# EAGLE design Aspen_Fever (EAGLE 9.6.2)
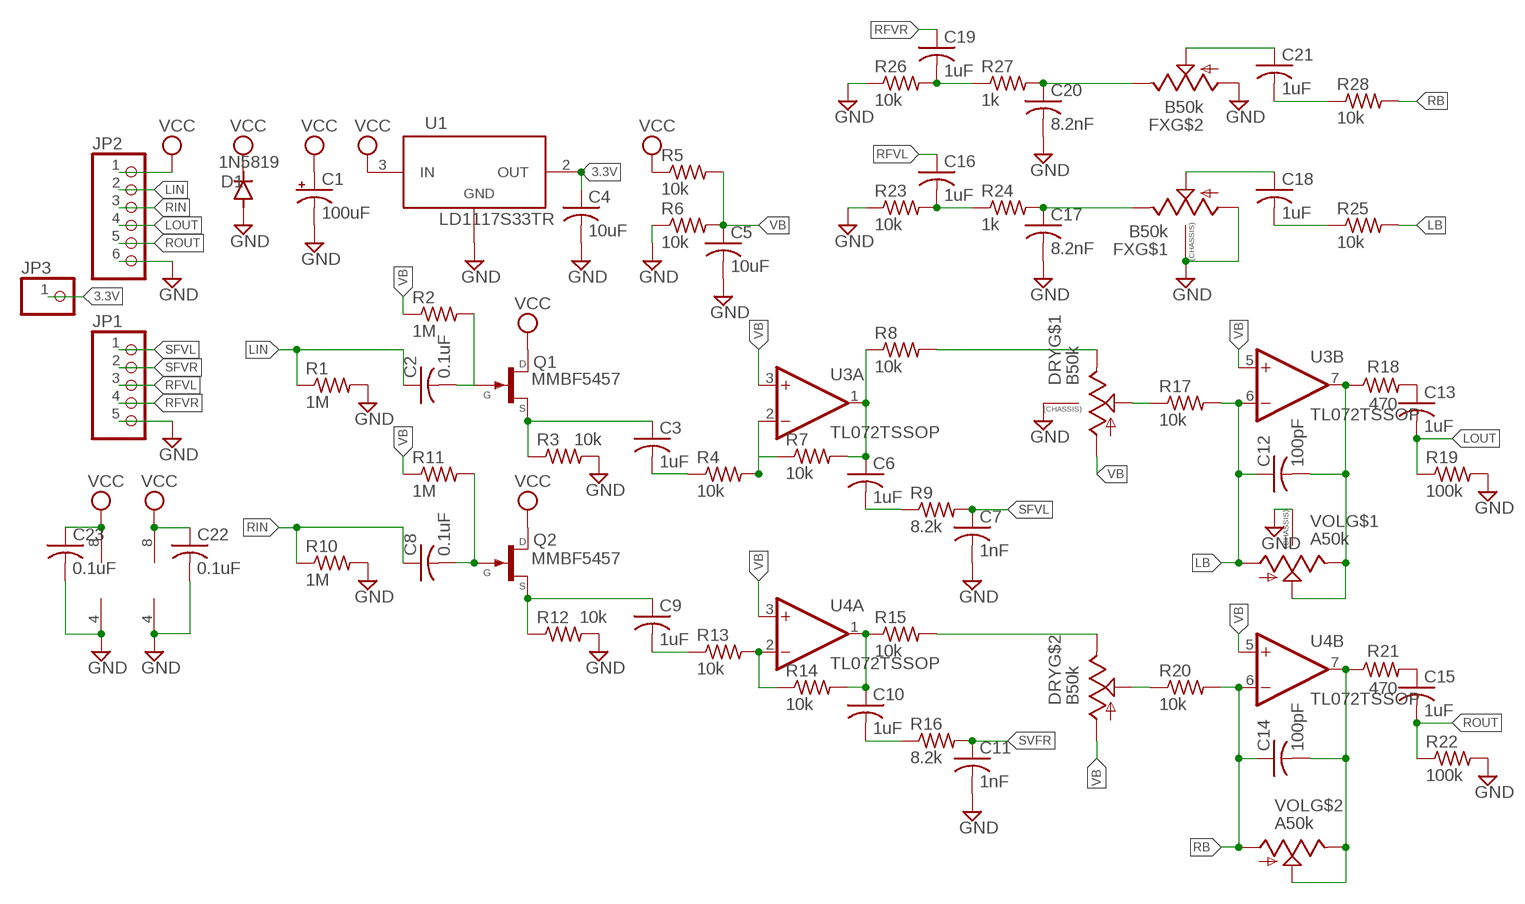
[diagram p0: schematic, sheet 1]

## Parts
C1  100uF  CAP_SMD+THRUPAN_B  [PAN_B_SMD+THRU]
C2  0.1uF  C-USC0402  [C0402]
C3  1uF  C-USC0603  [C0603]
C4  10uF  C-USC0805  [C0805]
C5  10uF  C-USC0805  [C0805]
C6  1uF  C-USC0603  [C0603]
C7  1nF  C-USC0402  [C0402]
C8  0.1uF  C-USC0402  [C0402]
C9  1uF  C-USC0603  [C0603]
C10  1uF  C-USC0603  [C0603]
C11  1nF  C-USC0402  [C0402]
C12  100pF  C-USC0402  [C0402]
C13  1uF  C-USC0603  [C0603]
C14  100pF  C-USC0402  [C0402]
C15  1uF  C-USC0603  [C0603]
C16  1uF  C-USC0603  [C0603]
C17  8.2nF  C-USC0402  [C0402]
C18  1uF  C-USC0603  [C0603]
C19  1uF  C-USC0603  [C0603]
C20  8.2nF  C-USC0402  [C0402]
C21  1uF  C-USC0603  [C0603]
C22  0.1uF  C-USC0402  [C0402]
C23  0.1uF  C-USC0402  [C0402]
D1  1N5819  DIODE-SOD123  [SOD123]
DRY  B50k  ALPHA-9MM-DUALPOT  [DUAL_9MM_SNAP-IN_POT]
FX  B50k  ALPHA-9MM-DUALPOT  [DUAL_9MM_SNAP-IN_POT]
JP1  PINHD-1X5  [1X05]
JP2  PINHD-1X6  [1X06]
JP3  PINHD-1X1  [1X01]
Q1  MMBF5457  [SOT23]
Q2  MMBF5457  [SOT23]
R1  1M  R-US_R0402  [R0402]
R2  1M  R-US_R0402  [R0402]
R3  10k  R-US_R0402  [R0402]
R4  10k  R-US_R0402  [R0402]
R5  10k  R-US_R0402  [R0402]
R6  10k  R-US_R0402  [R0402]
R7  10k  R-US_R0402  [R0402]
R8  10k  R-US_R0402  [R0402]
R9  8.2k  R-US_R0402  [R0402]
R10  1M  R-US_R0402  [R0402]
R11  1M  R-US_R0402  [R0402]
R12  10k  R-US_R0402  [R0402]
R13  10k  R-US_R0402  [R0402]
R14  10k  R-US_R0402  [R0402]
R15  10k  R-US_R0402  [R0402]
R16  8.2k  R-US_R0402  [R0402]
R17  10k  R-US_R0402  [R0402]
R18  470  R-US_R0402  [R0402]
R19  100k  R-US_R0402  [R0402]
R20  10k  R-US_R0402  [R0402]
R21  470  R-US_R0402  [R0402]
R22  100k  R-US_R0402  [R0402]
R23  10k  R-US_R0402  [R0402]
R24  1k  R-US_R0402  [R0402]
R25  10k  R-US_R0402  [R0402]
R26  10k  R-US_R0402  [R0402]
R27  1k  R-US_R0402  [R0402]
R28  10k  R-US_R0402  [R0402]
U1  LD1117S33TR  [SOT-223]
U3  TL072TSSOP  [TSSOP-8]
U4  TL072TSSOP  [TSSOP-8]
VOL  A50k  ALPHA-9MM-DUALPOT  [DUAL_9MM_SNAP-IN_POT]

## Nets
3.3V: C4.1 JP3.1 U1.2(OUT) U1.4
GND: C1.- C1.--(-) C4.2 C5.2 C7.2 C11.2 C17.2 C20.2 C22.2 C23.2 D1.A DRY.CHASSIS1 DRY.CHASSIS2 FX.1(A) FX.1B(A) FX.CHASSIS1 FX.CHASSIS2 JP1.5 JP2.6 R1.2 R3.2 R6.1 R10.2 R12.2 R19.2 R22.2 R23.1 R26.1 U1.1(ADJ/GND) U3.4(P:V-) U4.4(P:V-) VOL.CHASSIS1 VOL.CHASSIS2
LB: C12.1 R17.2 R25.2 U3.6(B:-IN) VOL.1(A)
LIN: C2.1 JP2.2 R1.1
LOUT: C13.2 JP2.4 R19.1
N$1: C6.2 R9.1
N$2: C2.2 Q1.3(G) R2.2
N$3: C3.1 Q1.2(S) R3.1
N$4: C3.2 R4.1
N$5: R4.2 R7.1 U3.2(A:-IN)
N$6: C6.1 R7.2 R8.1 U3.1(A:OUT)
N$7: DRY.3(E) R8.2
N$8: C8.2 Q2.3(G) R11.2
N$9: C9.1 Q2.2(S) R12.1
N$10: R13.2 R14.1 U4.2(A:-IN)
N$11: C9.2 R13.1
N$12: C10.1 R14.2 R15.1 U4.1(A:OUT)
N$13: DRY.3B(E) R15.2
N$14: C10.2 R16.1
N$15: DRY.2(S) R17.1
N$16: C13.1 R18.2
N$17: C19.2 R26.2 R27.1
N$18: C12.2 R18.1 U3.7(B:OUT) VOL.2(S) VOL.3(E)
N$19: C16.2 R23.2 R24.1
N$21: DRY.2B(S) R20.1
N$22: C14.2 R21.1 U4.7(B:OUT) VOL.2B(S) VOL.3B(E)
N$23: C15.1 R21.2
N$24: C17.1 FX.3(E) R24.2
N$25: C18.2 R25.1
N$26: C18.1 FX.2(S)
N$27: C20.1 FX.3B(E) R27.2
N$28: C21.1 FX.2B(S)
N$29: C21.2 R28.1
RB: C14.1 R20.2 R28.2 U4.6(B:-IN) VOL.1B(A)
RFVL: C16.1 JP1.3
RFVR: C19.1 JP1.4
RIN: C8.1 JP2.3 R10.1
ROUT: C15.2 JP2.5 R22.1
SFVL: C7.1 JP1.1 R9.2
SFVR: JP1.2
SVFR: C11.1 R16.2
VB: C5.1 DRY.1(A) DRY.1B(A) R2.1 R5.2 R6.2 R11.1 U3.3(A:+IN) U3.5(B:+IN) U4.3(A:+IN) U4.5(B:+IN)
VCC: C1.+ C1.++(+) C22.1 C23.1 D1.C JP2.1 Q1.1(D) Q2.1(D) R5.1 U1.3(IN) U3.8(P:V+) U4.8(P:V+)

## Library data of the parts
C1 = MusicThingModular:CAP_SMD+THRU
C2-C23 = adafruit:C-US: CAPACITOR, American symbol
D1 = diode:DIODE-: DIODE
DRY FX VOL = MusicThingModular:ALPHA-9MM-DUALPOT: 9mm vertical snap-in pot, Alpha / Panasonic style, with a connection to the metal chassis for grounding
JP1 = pinhead:PINHD-1X5: PIN HEADER
JP2 = pinhead:PINHD-1X6: PIN HEADER
JP3 = pinhead:PINHD-1X1: PIN HEADER
Q1 Q2 = MMBF5457:MMBF5457*: N-Channel JFET; AVAILABILITY: Unavailable; DESCRIPTION: JFET N-Channel 25V 350mW Surface Mount SOT-23-3; MF: ON Semiconductor; MP: MMBF5457; PACKAGE: SOT-23-3 Fairchild Semiconductor; PRICE: None
R1-R28 = adafruit:R-US_: RESISTOR, American symbol
U1 = IC:LD1117S33TR: IC REG LINEAR 3.3V 800MA SOT223 Manufacturer's datasheet <http://www.st.com/content/ccc/resource/technical/document/datasheet/99/3b/7d/91/91/51/4b/be/CD00000544.pdf/files/CD00000544.pdf/jcr:content/translations/en.CD00000544.pdf>; CREATED_BY: PCBLayout.com; DIGIKEY_PART_NUMBER: 497-1242-2-ND; MANUFACTURER: STMicroelectronics; MPN: LD1117S33TR; PACKAGE: SOT-223
U3 U4 = MusicThingModular:TL072: Generic Dual Op Amp

## Board
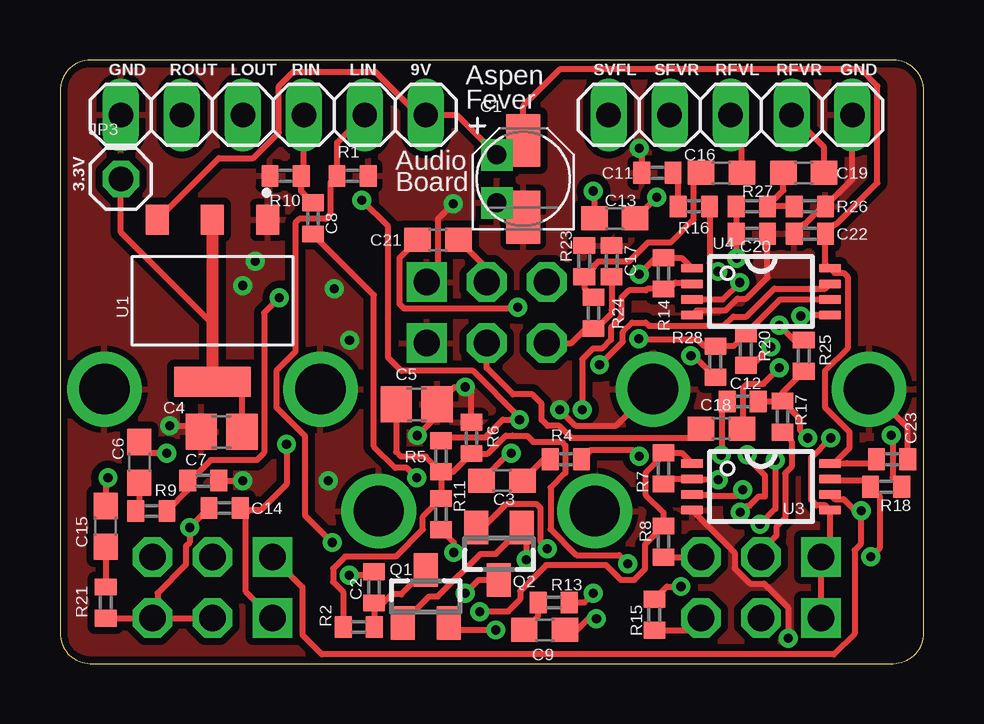
[diagram p1: board, top side]
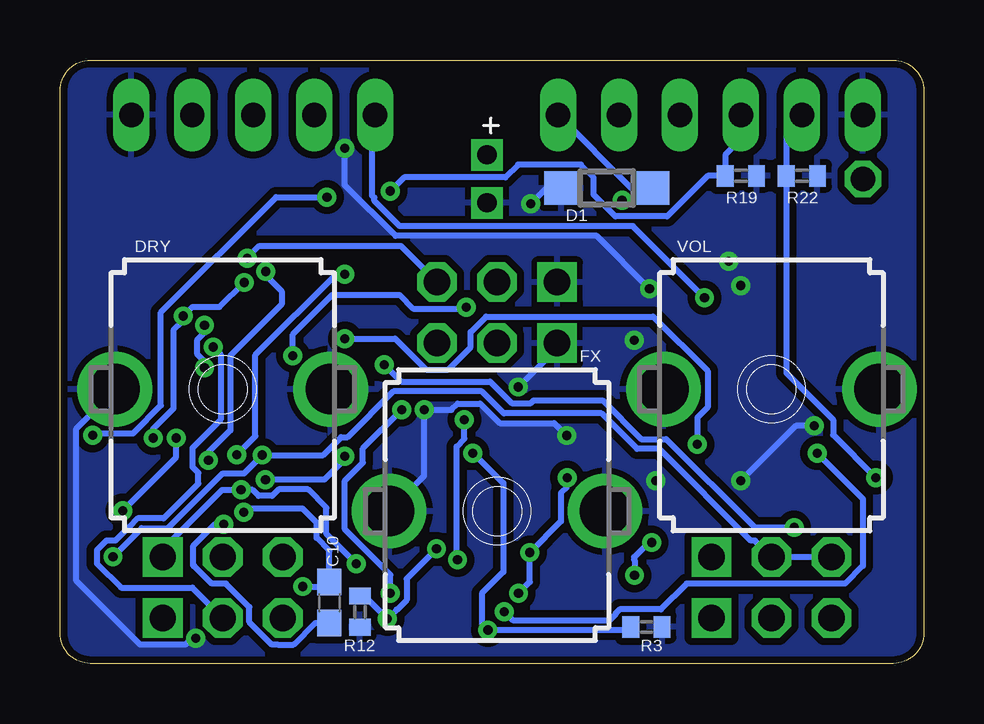
[diagram p2: board, bottom side, seen from below]

Size 35.99 x 25.14 mm. Coordinates in mm from the lower left corner, seen from the top.
Outline: 0,23.87 0,1.27 arc90 1.27,0 34.72,0 arc90 35.99,1.27 35.99,23.87 arc90 34.72,25.14 1.27,25.14 arc90 0,23.87
Copper layers (1*16): Top 0.035mm / dielectric 1.5mm / Bottom 0.035mm
Design rules "default *": minimum track width 6mil, minimum drill 0.35mm, track to track 6mil, track to pad 6mil, pad to pad 6mil, via to via 6mil, smd to smd 6mil, copper to edge 10mil, drill to drill 6mil, minimum pad ring 10mil, minimum via ring 8mil, stop-mask expansion 4mil, vias tented up to drill 0mil, thermal gap 10mil

### Footprints (pad centres in the part's own frame; a part is rotated, then mirrored left to right if it is on the bottom)
PAN_B_SMD+THRU = smd 2.2 x 1.4: + 1.6,0; - -1.6,0 | drill 0.8 pad 0.9 square: ++ 1,1.1; -- -1,1.1
C0402 = smd 0.7 x 0.9: 1 -0.65,0; 2 0.65,0
C0603 = smd 1.1 x 1: 1 -0.85,0; 2 0.85,0
C0805 = smd 1.3 x 1.5: 1 -0.85,0; 2 0.85,0
SOD123 = smd 1.4 x 1.4: A 1.9,0; C -1.9,0
DUAL_9MM_SNAP-IN_POT = drill 1.1 square: 1 -2.5,-7; 1B -2.5,-9.54 | drill 1.1 octagon: 2 0,-7; 2B 0,-9.54; 3 2.5,-7; 3B 2.5,-9.54 | drill 2.1 pad 2.54: CHASSIS1 -4.5,0; CHASSIS2 4.5,0
1X05 = drill 1.016 long: 1 -5.08,0; 2 -2.54,0; 3 0,0; 4 2.54,0; 5 5.08,0
1X06 = drill 1.016 long: 1 -6.35,0; 2 -3.81,0; 3 -1.27,0; 4 1.27,0; 5 3.81,0; 6 6.35,0
1X01 = drill 1.016 octagon: 1 0,0
SOT23 = smd 1 x 1.4: 1 -0.95,-1.1; 2 0.95,-1.1; 3 0,1.1
R0402 = smd 0.7 x 0.9: 1 -0.65,0; 2 0.65,0
SOT-223 = smd 1.26 x 0.96: 1 -3.375,2.3; 2 -3.375,0; 3 -3.375,-2.3 | smd 1.26 x 3.19: 4 3.375,0
TSSOP-8 = smd 0.9 x 0.35: 1 -2.875,0.975; 2 -2.875,0.325; 3 -2.875,-0.325; 4 -2.875,-0.975; 5 2.875,-0.975; 6 2.875,-0.325; 7 2.875,0.325; 8 2.875,0.975

### Placement (x,y rotation side)
C1  19.3,20.19 90 top
C2  13.08,3.17 270 top
C3  18.41,7.62 0 top
C4  6.73,9.65 180 top
C5  14.86,10.79 0 top
C6  3.3,8.38 270 top
C7  5.97,7.62 0 top
C8  10.54,18.54 270 top
C9  20.19,1.4 180 top
C10  24.77,2.54 270 bottom
C11  24.89,20.45 180 top
C12  28.45,10.92 180 top
C13  23.11,18.54 180 top
C14  6.86,6.48 180 top
C15  1.91,5.71 90 top
C16  27.56,20.45 180 top
C17  22.99,16.76 90 top
C18  27.56,9.78 0 top
C19  30.99,20.45 180 top
C20  28.83,17.91 0 top
C21  15.75,17.65 180 top
C22  31.24,17.91 180 top
C23  34.67,8.51 0 top
D1  13.21,19.81 180 bottom
DRY  29.21,11.43 0 bottom
FX  17.78,6.35 180 bottom
JP1  27.94,22.86 0 top
JP2  8.89,22.86 180 top
JP3  2.54,20.19 0 top
Q1  15.24,2.79 0 top
Q2  18.29,4.57 180 top
R1  12.19,20.32 0 top
R2  12.45,1.52 0 top
R3  11.56,1.52 0 bottom
R4  21.08,8.51 0 top
R5  15.88,8.64 270 top
R6  17.14,9.4 270 top
R7  25.15,8.13 90 top
R8  25.15,5.08 270 top
R9  3.81,6.35 0 top
R10  9.4,20.32 180 top
R11  15.88,6.22 270 top
R12  23.5,2.16 270 bottom
R13  20.57,2.54 0 top
R14  25.15,16.26 90 top
R15  24.77,2.03 270 top
R16  26.42,19.05 180 top
R17  30.1,10.29 90 top
R18  34.42,7.37 0 top
R19  7.62,20.32 0 bottom
R20  28.57,13.08 90 top
R21  1.91,2.54 90 top
R22  5.08,20.32 0 bottom
R23  21.84,16.76 270 top
R24  22.23,14.61 270 top
R25  30.99,12.83 270 top
R26  31.24,19.05 180 top
R27  28.83,19.05 180 top
R28  27.3,12.57 90 top
U1  6.35,15.11 270 top
U3  29.21,7.37 0 top
U4  29.21,15.49 0 top
VOL  6.35,11.43 0 bottom

### Tracks (layer width: path | path; a pad name or v marks a point on that pad's centre or on a via)
3.3V
  Top 0.254: C4.1 7.58,11.52 7.37,11.74 U1.4 6.35,14.15 2.54,17.96 JP3.1
  Top 0.508: U1.2 U1.4
GND  (via drill 0.38)
  Top 0.254: C22.2 31.01,18.32 31.06,18.32 31.79,19.05 R26.1 33.02,20.18 JP1.5 | R6.1 17.14,11.27 v16.89,11.52 16.43,11.52 C5.2 15.71,10.33 v14.88,9.5 | C7.2 v7.62,7.62 | U4.4 26.53,14.71 27.73,14.71 28.22,15.2 28.6,15.2 29.48,16.08 C20.2 | v20.82,10.57 21.08,10.3 21.48,9.91 23.19,9.91 DRY.CHASSIS2 | FX.1B 15.75,16.36 15.75,18.52 v16.38,19.15 | C23.2 35.32,9.82 DRY.CHASSIS1 | U3.4 28.11,4.62 28.11,3.97 28.75,3.33 29.34,3.33 30.34,2.32 v30.34,1.05 | v4.57,9.91 5.63,9.91 C4.2 | v24.13,21.46 24.24,21.35 C11.2
  Bottom 0.254: v16.89,11.52 15.28,13.13 FX.1 | FX.CHASSIS2 20.82,7.81 v20.82,10.57 19.68,10.57 19.42,10.83 18.48,10.83 17.67,10.02 15.4,10.02 v14.88,9.5 | v16.38,19.15 15.72,19.81 D1.A | v11.43,15.62 13.63,17.82 22.01,17.82 24.13,19.94 v24.13,21.46 | v30.34,1.05 30.5,1.05 30.77,0.79 32.65,0.79 35.31,3.44 35.31,9.78 33.71,11.38 DRY.CHASSIS1 | v4.57,9.91 5.33,9.91 v7.62,7.62
  other vias: 12.06,13.46 8.13,16.76 7.62,15.75 11.18,7.62
  pour Bottom (isolate 0.305): -0.51,25.4 -0.51,-1.02 36.58,-1.02 37.08,-0.51 37.08,24.89 36.07,25.91 0,25.91
  pour Top (isolate 0.305): 0,25.4 0,-0.51 36.07,-0.51 36.58,0 36.58,25.91 0.51,25.91
LB  (via drill 0.38)
  Top 0.254: VOL.1 10.09,3.19 10.09,1.2 10.91,0.38 32.25,0.38 33.11,1.24 33.11,4.72 33.38,5 v33.38,6.37 33.13,6.37 32.65,6.84 32.28,6.84 U3.6 | v31.15,9.4 30.83,9.72 30.83,10.21 R17.2 | C12.1 29.11,10.94 R17.2 | R17.2 30.1,11.29 R25.2
  Bottom 0.254: v33.38,6.37 31.15,8.6 v31.15,9.4
LIN  (via drill 0.38)
  Top 0.254: JP2.2 11.54,21.7 R1.1 11.27,20.05 11.27,18.73 11.07,18.52 9.97,18.52 9.81,18.36 9.81,12.99 9.01,12.19 9.01,10.67 10.2,9.48 10.2,6.18 v11.34,5.04 | C2.1 12.93,3.67 v12.05,3.67
  Bottom 0.254: v12.05,3.67 12.05,4.31 12.07,4.33 12.07,4.44 11.6,4.92 11.47,4.92 v11.34,5.04
LOUT  (via drill 0.38)
  Top 0.254: v22.23,19.68 22.26,19.65 C13.2
  Bottom 0.254: JP2.4 7.62,21.84 8.27,21.19 R19.1 9.01,20.32 10.69,18.63 12.85,18.63 13.75,19.53 13.75,20.25 14.29,20.79 16.9,20.79 17.43,20.26 21.65,20.26 v22.23,19.68
N$1
  Top 0.254: C6.2 3.3,6.49 R9.1
N$2
  Top 0.254: R2.2 13.1,2.51 C2.2 13.46,2.52 13.81,2.88 14.22,2.88 Q1.3
N$3  (via drill 0.38)
  Top 0.254: Q1.2 16.49,1.4 v18.16,1.4 | C3.1 18.71,8.76 v18.8,8.76
  Bottom 0.254: R3.1 12.33,1.4 v18.16,1.4 18.41,1.65 18.41,2.92 17.52,3.82 17.52,7.52 18.76,8.76 v18.8,8.76
N$4
  Top 0.254: R4.1 20.15,8.51 C3.2
N$5  (via drill 0.38)
  Top 0.254: R7.1 25.36,7.69 U3.2 26.37,7.66 v27.43,7.66 | v24.13,8.64 23.88,8.89 22.11,8.89 R4.2
  Bottom 0.254: v24.13,8.64 24.13,8.51 24.98,7.66 v27.43,7.66
N$6  (via drill 0.38)
  Top 0.254: U3.1 25.9,8.78 R7.2 25.15,8.67 24.42,7.94 24.42,7.01 25.15,6.28 R8.1 24.38,4.97 24.38,3.94 23.93,3.49 23.38,3.49 22.76,4.1 20.26,4.1 19.18,3.02 19.18,2.67 18.69,2.18 18.68,2.18 18.66,2.16 18.29,2.16 v17.49,2.16 | v4.45,8.76 3.77,8.76 C6.1
  Bottom 0.254: v4.45,8.76 2.54,6.86 2.54,4.06 3.28,3.33 9.88,3.33 10.96,2.25 12.67,2.25 12.84,2.09 12.84,2.05 13.08,1.8 17.13,1.8 v17.49,2.16
N$7
  Top 0.254: R8.2 DRY.3
N$8  (via drill 0.38)
  Top 0.254: Q2.3 17.44,3.47 v16.89,2.92 | v16.41,4.62 16.41,5.04 R11.2 | v14.86,7.75 14.46,8.15 13.97,8.15 13.08,9.04 13.08,15.35 C8.2
  Bottom 0.254: v16.89,2.92 16.41,3.4 v16.41,4.62 15.12,5.92 15.12,7.11 14.86,7.37 v14.86,7.75
N$9  (via drill 0.38)
  Top 0.254: C9.1 21.55,1.4 22.02,1.86 v22.35,1.86 | v20.3,4.78 20.02,5.06 20.02,6.49 19.85,6.65 18.62,6.65 17.64,5.67 Q2.2
  Bottom 0.254: R12.1 23.3,2.81 v22.35,1.86 21.97,2.25 21.95,2.25 21.55,2.64 21.55,3.53 v20.3,4.78
N$10  (via drill 0.38)
  Top 0.254: U4.2 26.28,15.88 25.65,15.88 25.39,15.61 R14.1 24.47,15.61 24.41,15.54 23.7,15.54 23.39,15.24 23.39,14.42 22.95,13.98 22.95,13.49 22.58,13.12 22.2,13.12 21.76,12.68 v21.76,10.58 | v22.23,2.92 21.84,2.54 R13.2
  Bottom 0.254: v21.76,10.58 23.37,8.97 23.37,8.37 24.12,7.62 24.12,5.59 22.23,3.7 v22.23,2.92
N$11
  Top 0.254: C9.2 19.92,1.98 R13.1
N$12  (via drill 0.38)
  Top 0.254: U4.1 25.9,16.91 R14.2 24.82,16.91 v24.13,16.22 | v28.63,8.69 28.63,8.57 29.38,7.82 29.38,6.96 29.12,6.96 28.73,6.57 28.6,6.57 v28.34,6.3 | R15.1 25.29,3.21 v25.88,3.21
  Bottom 0.254: v24.13,16.22 24.49,16.22 27.85,12.86 27.85,9.47 v28.63,8.69 | v28.34,6.3 28.18,6.45 26.92,6.45 25.88,6.45 25.3,5.87 25.3,5.23 24.77,4.7 C10.1 24.95,3.21 v25.88,3.21
N$13
  Top 0.254: R15.2 26.2,1.38 DRY.3B
N$14  (via drill 0.38)
  Top 0.254: R16.1 27.07,16.68 v27.41,16.33 | v29.81,8.47 29.81,6.44 v29.17,5.8
  Bottom 0.254: v29.81,8.47 29.81,8.8 28.89,9.71 28.89,12.83 26.76,14.96 26.76,15.52 27.41,16.18 v27.41,16.33 | C10.2 25.35,1.69 26.25,0.79 26.92,0.79 27.17,0.79 28.11,1.72 28.11,2.35 29.08,3.33 29.67,3.33 30.4,4.06 30.44,4.06 30.44,4.91 29.55,5.8 v29.17,5.8
N$15
  Top 0.254: DRY.2 29.59,4.81 29.59,5.07 29.85,5.33 29.85,5.71 30.23,6.08 30.21,6.09 30.21,7.92 30.48,8.19 30.48,9.26 R17.1
N$16  (via drill 0.38)
  Top 0.254: v24.87,19.43 23.98,18.54 C13.1 | v34.63,9.51 34.68,9.51 34.69,9.49 34.69,7.74 R18.2
  Bottom 0.254: v34.63,9.51 34.55,9.59 32.95,9.59 31.79,10.75 31.79,14.63 26.99,19.43 v24.87,19.43
N$17
  Top 0.254: R26.2 R27.1 30.14,19.71 C19.2
N$18  (via drill 0.38)
  Top 0.254: C12.2 27.58,10.7 27.58,8.71 v27.56,8.69 | v33.78,4.45 33.8,4.45 34.15,4.8 34.15,6.99 R18.1 33.51,7.62 32.16,7.62 U3.7
  Bottom 0.254: VOL.3 VOL.2 7.04,5.12 7.2,5.12 11.03,8.95 11.95,8.95 13.43,10.43 17.5,10.43 18.41,11.34 22.1,11.34 24,9.44 24.28,9.44 25.03,8.69 v27.56,8.69 28.32,7.92 29.21,7.92 31.5,5.64 32.59,5.64 v33.78,4.45
N$19
  Top 0.254: R24.1 21.84,15.64 R23.2 22.26,16.53 22.26,16.58 22.42,16.74 23.7,16.74 24.5,17.54 25.45,17.54 26.39,18.48 26.39,20.13 C16.2
N$21  (via drill 0.38)
  Top 0.254: v29.61,13.19 28.85,12.43 R20.1
  Bottom 0.254: v29.61,13.19 29.3,12.88 29.3,10.16 30.48,8.98 30.48,8.19 30.23,7.94 30.23,7.49 31.67,6.04 32.76,6.04 33.12,5.68 33.18,5.63 33.68,5.12 34.06,5.12 34.45,4.72 34.45,4.17 33.45,3.16 30.48,3.16 DRY.2B
N$22  (via drill 0.38)
  Top 0.254: 4.06,1.89 VOL.3B R21.1 | 4.06,1.89 VOL.2B | 4.06,1.89 4.06,2.94 5.25,4.12 5.25,4.89 5.4,5.04 v5.4,5.67 C14.2 | U4.7 31.89,15.62 29.77,15.62 28.6,14.46 28.05,14.46 27.66,14.06 24.54,14.06 24.4,14.21 23.84,14.21 23.45,13.81 23.45,13.41 22.75,12.71 v22.48,12.45
  Bottom 0.254: v5.4,5.67 7.05,5.67 10.73,9.35 11.78,9.35 13.39,10.96 16.26,10.96 16.37,10.85 17.17,10.85 18.07,11.75 21.78,11.75 v22.48,12.45
N$23
  Top 0.254: C15.1 R21.2
N$24
  Top 0.254: FX.3 21.3,13.35 21.9,13.96 R24.2 22.35,13.96 22.99,14.59 22.99,14.73 C17.1
N$25  (via drill 0.38)
  Top 0.254: R25.1 30.59,13.48 v29.97,14.1 | C18.2 28.47,9.84 28.47,11.49 28.63,11.65 29.3,11.65 v29.97,12.32
  Bottom 0.254: v29.97,14.1 29.97,13.78 30.28,13.47 30.28,12.91 29.97,12.6 v29.97,12.32
N$26
  Top 0.254: FX.2 17.78,12.32 18.89,11.21 19.68,11.21 20.07,10.82 20.07,10.15 20.32,9.9 20.81,9.9 21.3,9.41 26.34,9.41 C18.1
N$27  (via drill 0.38)
  Top 0.254: v28.19,16.89 28.18,16.91 C20.1 R27.2
  Bottom 0.254: FX.3B 21.79,17.4 27.69,17.4 v28.19,16.89
N$28
  Top 0.254: C21.1 17.78,16.47 FX.2B
N$29  (via drill 0.38)
  Top 0.254: C21.2 14.14,16.89 14.14,14.99 14.34,14.79 19.01,14.79 v19.07,14.85 | R28.1 26.4,12.83 v26.29,12.83
  Bottom 0.254: v26.29,12.83 26.29,13.72 24.65,15.36 21.84,15.36 21.27,14.79 19.07,14.79 v19.07,14.85
RB  (via drill 0.38)
  Top 0.254: U4.6 30.01,15.17 R20.2 28.07,13.22 R28.2 26.84,13.22 26.57,13.5 24.16,13.5 v24.12,13.53 | VOL.1B 7.75,2.99 7.75,6.24 | 7.75,6.24 C14.1 | v9.44,9.13 9.44,7.46 8.36,6.38 7.89,6.38 7.75,6.24
  Bottom 0.254: v9.44,9.13 9.44,10.24 9.01,10.67 9.01,12.19 11.28,14.45 18.24,14.45 18.88,13.81 18.88,13.18 19.82,12.25 20.74,12.25 22.03,13.53 v24.12,13.53
RFVL
  Top 0.254: C16.1 28.41,22.39 JP1.3
RFVR
  Top 0.254: C19.1 31.84,21.5 JP1.4
RIN
  Top 0.254: JP2.3 10.16,20.43 R10.1 10.05,19.68 C8.1
ROUT  (via drill 0.38)
  Top 0.254: v2,7.75 2,7.59 1.91,7.49 C15.2
  Bottom 0.254: JP2.5 5.73,22.21 R22.1 5.73,12.11 3.78,10.16 3.78,9.53 v2,7.75
SFVL  (via drill 0.38)
  Top 0.254: R9.2 5.32,7.21 C7.1 5.42,7.62 6.28,8.48 8.2,8.48 8.51,8.79 8.51,14.61 v9.14,15.24
  Bottom 0.254: v9.14,15.24 12.12,18.22 21.84,18.22 22.9,19.28 22.9,19.41 22.99,19.5 22.99,22.73 JP1.1
SVFR
  Top 0.254: R16.2 25.77,20.22 C11.1
VB  (via drill 0.38)
  Top 0.254: R5.2 16.38,7.99 R6.2 17.83,8.75 18.57,9.49 18.86,9.49 18.87,9.49 19.47,9.49 19.72,9.24 20.9,9.24 21.06,9.07 21.06,7.94 20.44,7.32 20.44,5.59 21.52,4.51 23.3,4.51 v23.65,4.16 | R5.2 R11.1 15.12,6.12 15.12,5.59 13.98,4.45 11.88,4.45 11.38,3.95 11.38,3.4 11.8,2.98 R2.1 | DRY.1B DRY.1 32.09,4.8 U3.5 31.89,6.59 31.52,6.59 31.29,6.81 31.29,8.58 v32.11,9.4 | U4.5 30.9,14.52 v30.86,14.48 | v28.32,15.88 27.61,15.17 U4.3 | C5.1 14.01,8.81 14.2,8.62 15.24,8.62 R5.2 | U3.3 27.1,7.04 27.15,6.99 28.19,6.99 v28.45,7.24
  Bottom 0.254: v28.32,15.88 29.34,14.86 30.48,14.86 v30.86,14.48 30.86,14.29 31.27,13.88 31.27,10.62 32.11,9.78 v32.11,9.4 | DRY.1 31.71,4.76 29.23,7.24 v28.45,7.24 27.96,7.24 27.71,6.99 27.15,6.99 26.89,7.25 25.65,7.25 24.89,6.49 24.89,5.4 v23.65,4.16
VCC  (via drill 0.38)
  Top 0.254: Q1.1 15.39,2.79 15.75,2.79 17.53,4.57 18.16,4.57 19.24,5.65 Q2.1 19.43,5.48 v19.43,4.32 | v12.57,19.3 13.67,18.21 13.67,12.75 14.22,12.19 17.21,12.19 19.14,10.26 v19.14,10.16 18.45,10.16 17.71,9.42 16.01,9.42 R5.1 | U1.3 6.62,21.06 8.05,21.06 9.12,22.12 9.12,24.05 9.73,24.66 13.13,24.66 14.94,22.86 JP2.1 16.54,22.86 C1.++ 18.8,21.79 C1.+ 19.3,23.23 20.83,24.75 33.36,24.75 34.06,24.05 34.06,20.02 32.36,18.32 32.31,18.32 C22.1 31.89,16.66 U4.8 32.28,16.27 32.65,16.27 32.81,16.11 32.81,13.13 31.87,12.19 31.87,10.67 32.89,9.65 32.89,8.98 32.26,8.34 | U3.8 32.26,8.34 | 32.26,8.34 32.78,8.34 32.79,8.35 33.86,8.35 C23.1
  Bottom 0.254: JP2.1 12.19,19.81 D1.C 11.82,19.3 v12.57,19.3 | v19.14,10.16 19.14,9.37 19.47,9.04 19.47,4.36 v19.43,4.32

### Text on the board
tPlace: GND | ROUT | LOUT | RIN | LIN | 9V | SVFL | SFVR | RFVL | RFVR | GND | Aspen | Fever | Audio | 3.3V | Board